# Altium schematic sheet Sheet1.SchDoc
size A3
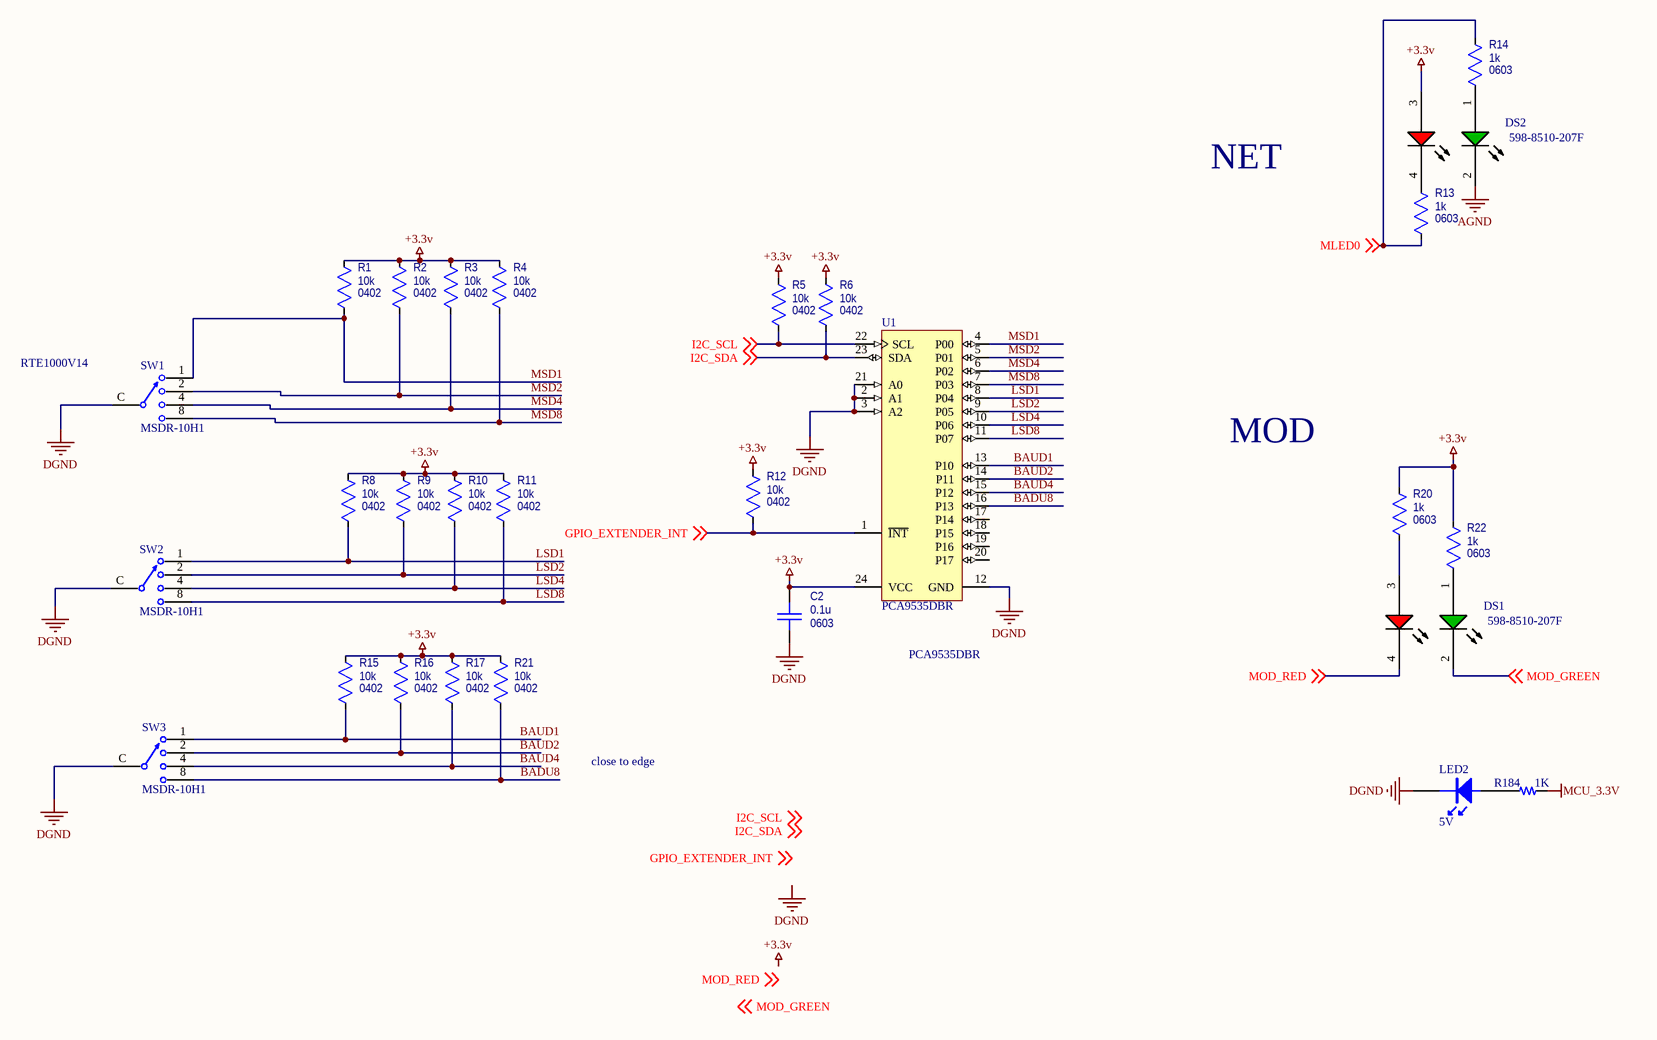
[diagram p0: Sheet1.SchDoc]

## Parts
C2  value 0.1u  Package: 0603  [CAPC1608X092N_0603]  (hidden comment: Capacitor_0603)
DS1  598-8510-207F  [DIAL-1208-4_V]
DS2  598-8510-207F  [DIAL-1208-4_V]
LED2  5V  [0603LED]
R1  value 10k  Package: 0402  [RESC1005X040N_0402]  (hidden comment: Resistor_0402)
R2  value 10k  Package: 0402  [RESC1005X040N_0402]  (hidden comment: Resistor_0402)
R3  value 10k  Package: 0402  [RESC1005X040N_0402]  (hidden comment: Resistor_0402)
R4  value 10k  Package: 0402  [RESC1005X040N_0402]  (hidden comment: Resistor_0402)
R5  value 10k  Package: 0402  [RESC1005X040N_0402]  (hidden comment: Resistor_0402)
R6  value 10k  Package: 0402  [RESC1005X040N_0402]  (hidden comment: Resistor_0402)
R8  value 10k  Package: 0402  [RESC1005X040N_0402]  (hidden comment: Resistor_0402)
R9  value 10k  Package: 0402  [RESC1005X040N_0402]  (hidden comment: Resistor_0402)
R10  value 10k  Package: 0402  [RESC1005X040N_0402]  (hidden comment: Resistor_0402)
R11  value 10k  Package: 0402  [RESC1005X040N_0402]  (hidden comment: Resistor_0402)
R12  value 10k  Package: 0402  [RESC1005X040N_0402]  (hidden comment: Resistor_0402)
R13  value 1k  Package: 0603  [RESC1608X055N_0603]  (hidden comment: Resistor_0603)
R14  value 1k  Package: 0603  [RESC1608X055N_0603]  (hidden comment: Resistor_0603)
R15  value 10k  Package: 0402  [RESC1005X040N_0402]  (hidden comment: Resistor_0402)
R16  value 10k  Package: 0402  [RESC1005X040N_0402]  (hidden comment: Resistor_0402)
R17  value 10k  Package: 0402  [RESC1005X040N_0402]  (hidden comment: Resistor_0402)
R20  value 1k  Package: 0603  [RESC1608X055N_0603]  (hidden comment: Resistor_0603)
R21  value 10k  Package: 0402  [RESC1005X040N_0402]  (hidden comment: Resistor_0402)
R22  value 1k  Package: 0603  [RESC1608X055N_0603]  (hidden comment: Resistor_0603)
R184  1K  [0603R]
SW1  MSDR-10H1  [SNGN-MSDR-10H1_V]
SW2  MSDR-10H1  [SNGN-MSDR-10H1_V]
SW3  MSDR-10H1  [SNGN-MSDR-10H1_V]
U1  PCA9535DBR  [DB0024A_L]

## Nets
+3.3v: C2.1 DS2.3(RED-A) R1.2 R2.2 R3.2 R4.2 R5.2 R6.2 R8.2 R9.2 R10.2 R11.2 R12.2 R15.2 R16.2 R17.2 R20.2 R21.2 R22.2 U1.24(VCC)
AGND: DS2.2(GREEN-K)
DGND: C2.2 LED2.2 SW1.C SW2.C SW3.C U1.2(A1) U1.3(A2) U1.12(GND) U1.21(A0)
MCU_3.3V: R184.2
BADU8: R21.1 SW3.8 U1.16(P13)
BAUD1: R15.1 SW3.1 U1.13(P10)
BAUD2: R16.1 SW3.2 U1.14(P11)
BAUD4: R17.1 SW3.4 U1.15(P12)
GPIO_EXTENDER_INT: R12.1 U1.1(~{INT}) ; off-sheet GPIO_EXTENDER_INT
I2C_SCL: R5.1 U1.22(SCL) ; off-sheet I2C_SCL
I2C_SDA: R6.1 U1.23(SDA) ; off-sheet I2C_SDA
LSD1: R8.1 SW2.1 U1.8(P04)
LSD2: R9.1 SW2.2 U1.9(P05)
LSD4: R10.1 SW2.4 U1.10(P06)
LSD8: R11.1 SW2.8 U1.11(P07)
MLED0: R13.1 R14.2 ; off-sheet MLED0
MOD_GREEN: DS1.2(GREEN-K) ; off-sheet MOD_GREEN
MOD_RED: DS1.4(RED-K) ; off-sheet MOD_RED
MSD1: R1.1 SW1.1 U1.4(P00)
MSD2: R2.1 SW1.2 U1.5(P01)
MSD4: R3.1 SW1.4 U1.6(P02)
MSD8: R4.1 SW1.8 U1.7(P03)
NetDS1_1: DS1.1(GREEN-A) R22.1
NetDS1_3: DS1.3(RED-A) R20.1
NetDS2_1: DS2.1(GREEN-A) R14.1
NetDS2_4: DS2.4(RED-K) R13.2
NetLED2_1: LED2.1 R184.1

Not connected (* = marked no-connect by the designer): U1 17(P14) 18(P15) 19(P16) 20(P17)

## Notes on the sheet
- NET
- RTE1000V14
- MOD
- PCA9535DBR
- close to edge
- Labels drawn without touching a wire or pin: +3.3v, DGND, GPIO_EXTENDER_INT, I2C_SCL, I2C_SDA, MOD_GREEN, MOD_RED

## Library data of the parts
C2 = Capacitor_0603: Capacitor, MLCC; Manufacturer: KEMET; PartNumber: C0603C104M5RACTU; Tolerance: [tol]; TempCo: [tempco]; Voltage Rating: [voltage]; ComponentLink1URL: *; Current Rating: *; ComponentLink1Description: Datasheet; Power Rating: *; SupplierDescription: CAP CER 0.1UF 50V X7R 0603
DS1 DS2 = 598-8510-207F: Bi-Color LED, 2.2 V, -40 to 100 degC, 4-Pin SMD (1208), RoHS, Tape and Reel; Manufacturer: Dialight; Dominant Wave Length: 470/525/635nm; Product Length (mm): 1mm; Viewing Angle: 160deg; Number of  Elements: 3; Forward Voltage: 3.4/3.4/2.4V; Rad Hardened: No; Luminous Intensity: 90/120/60mcd; Test Current (It): 20mA; Shape Type: Rectangular; Product Depth (mm): 3.2mm; Chip Material: InGaN/InGaN/AlGaInP; Main Category: ChipLED; Reverse Voltage: 5V; Power Dissipation: 68/68/64W; DELETED: Compliant; Emitting Color: Blue/Green/Red; Mounting Technology: SurfaceMount; Datasheet URL: https://datasheet.ciiva.com/22748/1484480-22748121.pdf; Package Reference: 1208; Packaging: TapeandReel; Lens Dimensions: 2x1x1mm; Datasheet Version: 10/2008; Operating Temperature Classification: Industrial; Type: Bi-Color; Product Height (mm): 1mm; Pin Count: 4; Lum Intensity: 90/120/60mcd; Operating Temp Range: -40Cto100C; Package Type: SMD; Mounting: SurfaceMount; Package Description: 4-Pin Surface Mount Device, Body 3.2 x 1 mm; Forward Current: 20mA; High Brightness: No; Manufacturer URL: http://www.dialight.com/
LED2 = LED
R1-R6 R8-R12 R15-R17 R21 = Resistor_0402: Resistor, Standard; Manufacturer: Panasonic; PartNumber: ERJ-2RKF1002X; Power Rating: [power]; TempCo: [tempco]; Tolerance: tol; ComponentLink1URL: *; ComponentLink1Description: Datasheet; SupplierDescription: RES SMD 10K OHM 1% 1/10W 0402
R13 R14 R20 R22 = Resistor_0603: Resistor, Standard; Manufacturer: Yageo; PartNumber: RC0603FR-071KL; Power Rating: [power]; TempCo: [tempco]; Tolerance: tol; ComponentLink1URL: *; ComponentLink1Description: Datasheet; SupplierDescription: RES 1k OHM 1% 1/10W 0603
R184 = R: Value: 1k/1%
SW1-SW3 = MSDR-10H1: Mini Rotary DIP Switch, 10 Postions, Right Angle Thru-Hole, -60 to 125 degC, 6-Pin THT, RoHS; Part No: MSDR-16H1; Manufacturer: SUNGMUN ELECTRONICS; Mounting: ThroughHole; Manufacturer URL: http://www.sungmun.co.kr/
U1 = PCA9535DBR: Remote 16-Bit I2C and SMBus Low-Power I/O Expander with Interrupt Output & Config. Registers, 2.3 to 5.5 V, -40 to 85 degC, 24-pin SSOP (DB), Green (RoHS & no Sb/Br); Manufacturer: Texas Instruments; Interrupt Output: Yes; fSCLK(Max)(MHz): 400; SubFamily: I2C IO Expander; I2C Address: 1110 1xx; No. of Outputs: 2; # of I/Os: 16; VCC(Min)(V): 2.3; VCC(Max)(V): 5.5; Eco-Plan: Green (RoHS & no Sb/Br); Mounting Technology: Surface Mount; PackageDescription: 24-Pin Plastic Small Outline Package, 8.2 x 5.3 mm Body, 0.65 mm Pitch; Vcc range(V): 2.3 to 5.5; Max Frequency(kHz): 400; PackageReference: DB0024A; Low Power: Yes; PartNumber: PCA9535DBR; ComponentLink2URL: http://www.ti.com/litv/pdf/mpds211a; Reset Input: Yes; PackageVersion: revE, Dec-2001; ComponentLink1URL: http://www.ti.com/general/docs/lit/getliterature.tsp?genericPartNumber=PCA9539&fileType=pdf; Code_JEDEC: MO-150; DatasheetVersion: SCPS130F; ComponentLink1Description: Datasheet; Push-Pull I/O Type: Yes; 5V Tolerant I/O: Yes; Configuration Registers: Yes; ComponentLink2Description: Package Specification